# EAGLE design motor-slaves (EAGLE 9.5.2)
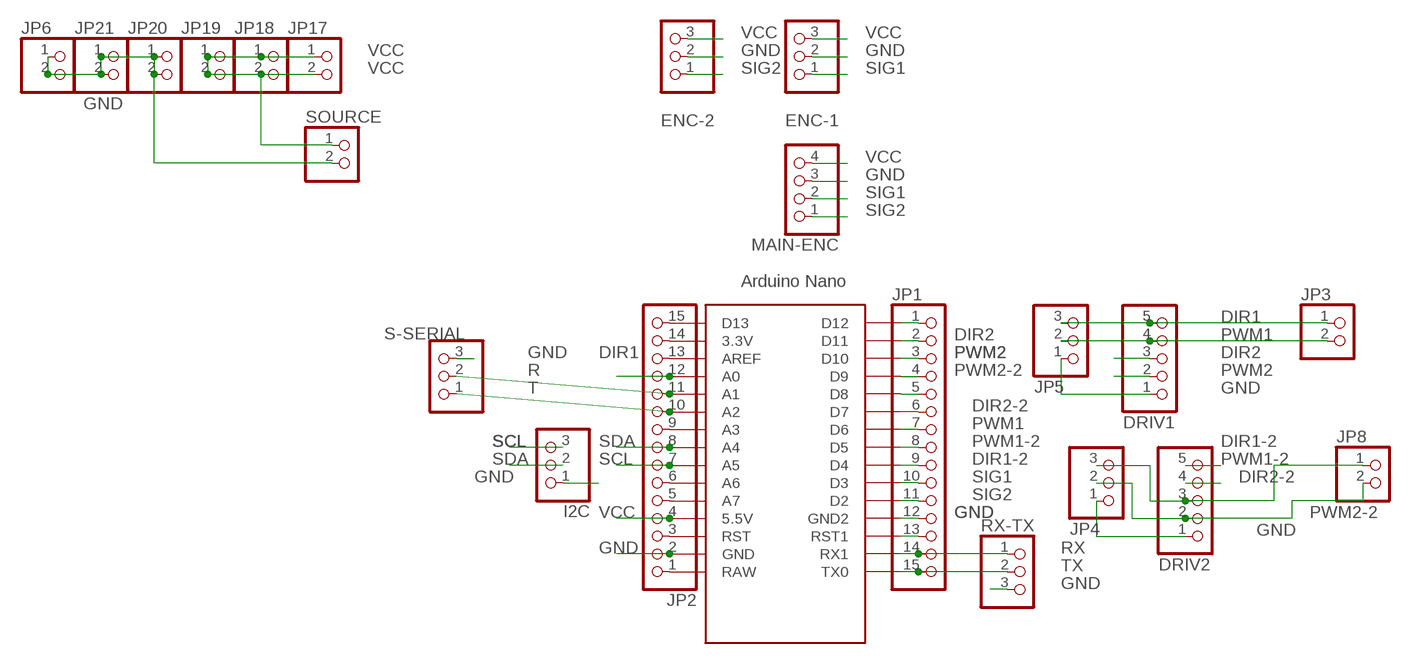
[diagram p0: schematic, sheet 1]

## Parts
DRIV1  PINHD-5_DATA  [1X05_DATA]
DRIV2  PINHD-5_DATA  [1X05_DATA]
ENC-1  PINHD-3_DATA  [1X03_DATA]
ENC-2  PINHD-3_DATA  [1X03_DATA]
I2C  PINHD-3_DATA  [1X03_DATA]
JP1  PINHD-1X15  [1X15]
JP2  PINHD-1X15  [1X15]
JP3  PINHD-2_DATA  [1X02_DATA]
JP4  PINHD-3_DATA  [1X03_DATA]
JP5  PINHD-3_DATA  [1X03_DATA]
JP6  PINHD-1X2  [1X02]
JP8  PINHD-2_DATA  [1X02_DATA]
JP17  PINHD-1X2  [1X02]
JP18  PINHD-1X2  [1X02]
JP19  PINHD-1X2  [1X02]
JP20  PINHD-1X2  [1X02]
JP21  PINHD-1X2  [1X02]
MAIN-ENC  PINHD-4_DATA  [1X04_DATA]
RX-TX  PINHD-3_DATA  [1X03_DATA]
S-SERIAL  PINHD-3_DATA  [1X03_DATA]
SOURCE  PINHD-1X2  [1X02]
U$1  ARDUINO_NANO  [NANO]

## Nets
DIR1: DRIV1.5 JP2.12 JP3.1 JP5.3 U$1.A0
DIR1-2: DRIV2.5 JP1.9 U$1.D4
DIR2: DRIV1.3 JP1.2 U$1.D11
DIR2-2: DRIV2.3 JP1.6 JP4.3 JP8.1 U$1.D7
GND: DRIV1.1 DRIV2.1 ENC-1.2 ENC-2.2 I2C.1 JP1.12 JP2.2 JP4.1 JP5.1 JP6.1 JP6.2 JP20.1 JP20.2 JP21.1 JP21.2 MAIN-ENC.3 RX-TX.3 S-SERIAL.3 SOURCE.2 U$1.GND U$1.GND1(GND2)
N$1: JP1.1 U$1.D12
N$2: JP1.5 U$1.D8
N$13: JP1.13 U$1.RST1
N$16: JP2.1 U$1.RAW
N$18: JP2.3 U$1.RST
N$20: JP2.5 U$1.A7
N$21: JP2.6 U$1.A6
N$24: JP2.9 U$1.A3
N$28: JP2.13 U$1.AREF
N$29: JP2.14 U$1.3.3V
N$30: JP2.15 U$1.D13
PWM1: DRIV1.4 JP1.7 JP3.2 JP5.2 U$1.D6
PWM1-2: DRIV2.4 JP1.8 U$1.D5
PWM2: DRIV1.2 JP1.3 U$1.D10
PWM2-2: DRIV2.2 JP1.4 JP4.2 JP8.2 U$1.D9
R: JP2.11 S-SERIAL.2 U$1.A1
RX: JP1.14 RX-TX.1 U$1.RX1
SCL: I2C.3 JP2.7 U$1.A5
SDA: I2C.2 JP2.8 U$1.A4
SIG1: ENC-1.1 JP1.10 MAIN-ENC.2 U$1.D3
SIG2: ENC-2.1 JP1.11 MAIN-ENC.1 U$1.D2
T: JP2.10 S-SERIAL.1 U$1.A2
TX: JP1.15 RX-TX.2 U$1.TX0
VCC: ENC-1.3 ENC-2.3 JP2.4 JP17.1 JP17.2 JP18.1 JP18.2 JP19.1 JP19.2 MAIN-ENC.4 SOURCE.1 U$1.5V(5.5V)

## Library data of the parts
DRIV1 DRIV2 = MIA_LIBRARY-2-2-2:PINHD-5_DATA: PIN HEADER
ENC-1 ENC-2 I2C JP4 JP5 RX-TX S-SERIAL = MIA_LIBRARY-2-2-2:PINHD-3_DATA: PIN HEADER
JP1 JP2 = MIA_LIBRARY-2-2-2:PINHD-1X15: PIN HEADER
JP3 JP8 = MIA_LIBRARY-2-2-2:PINHD-2_DATA: PIN HEADER
JP6 JP17-JP21 SOURCE = MIA_LIBRARY-2-2-2:PINHD-1X2: PIN HEADER
MAIN-ENC = MIA_LIBRARY-2-2-2:PINHD-4_DATA: PIN HEADER
U$1 = MIA_LIBRARY:ARDUINO_NANO: Arduino Nano

## Board
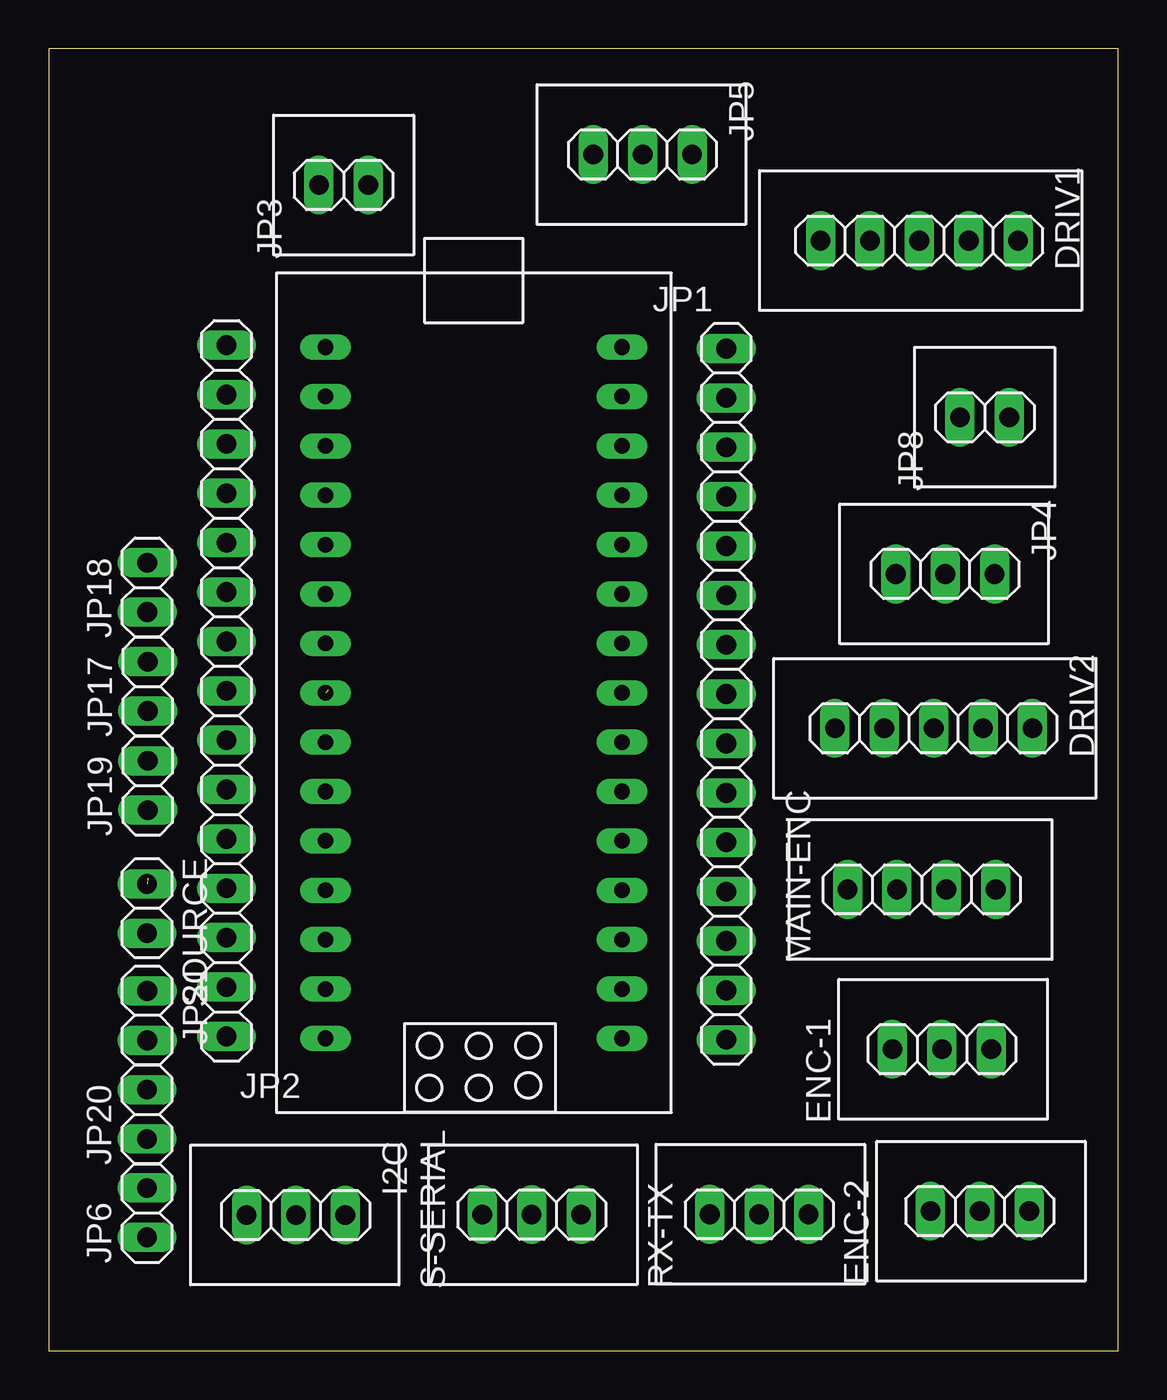
[diagram p1: board, top side]
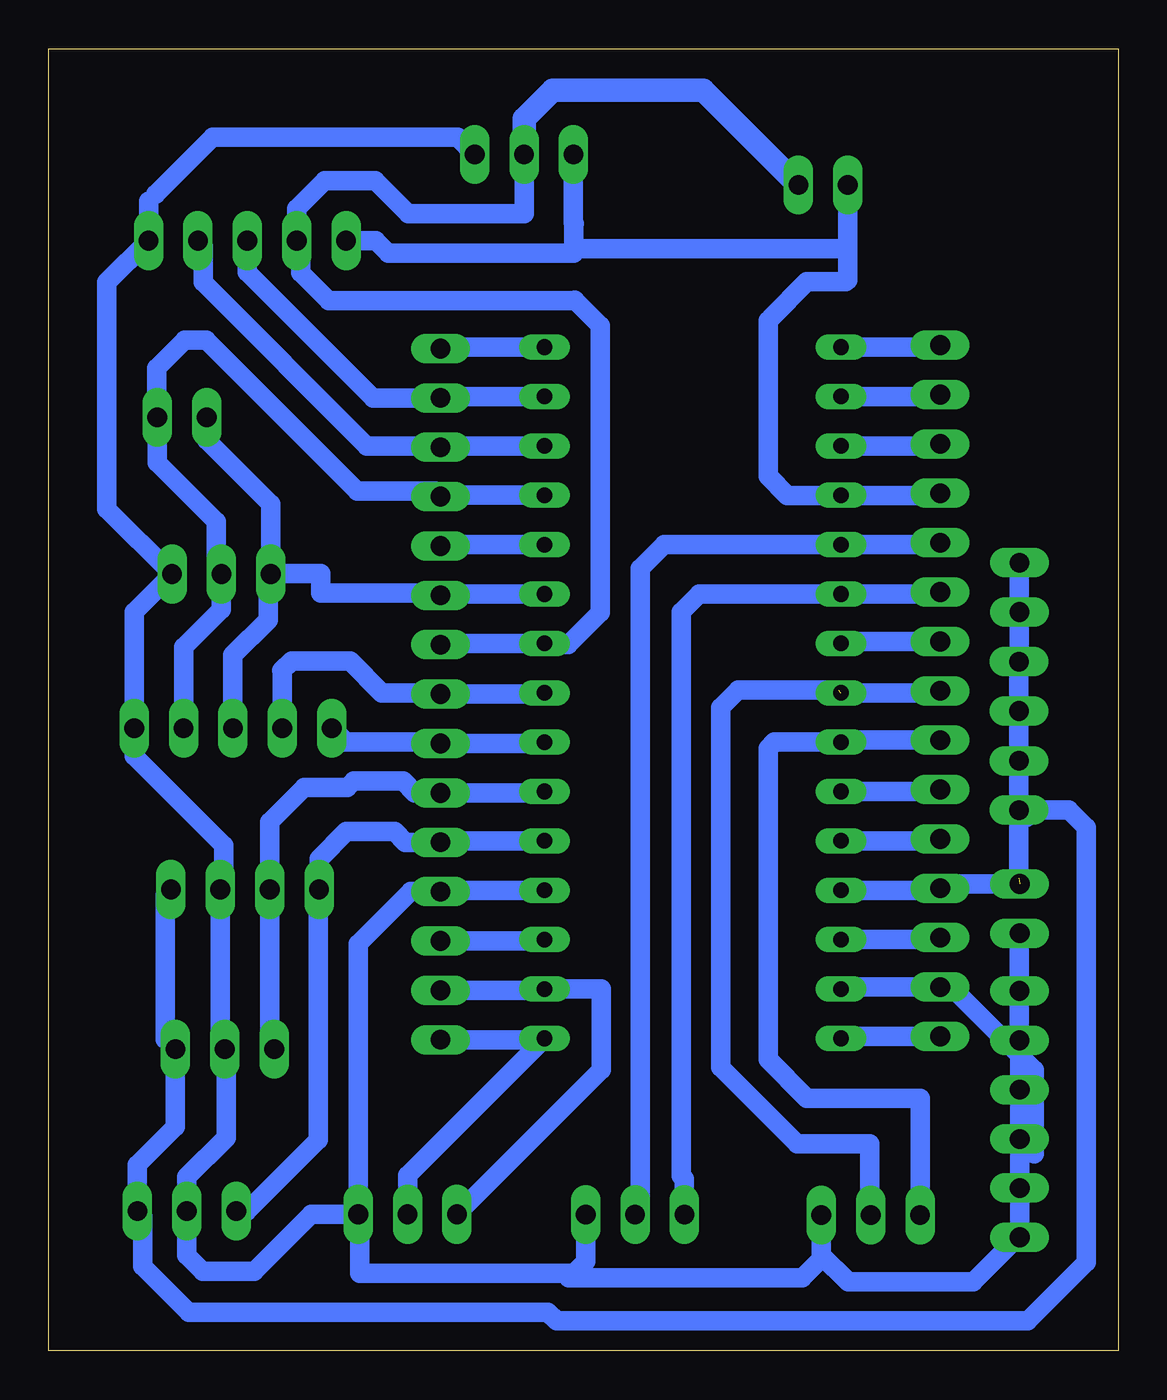
[diagram p2: board, bottom side, seen from below]

Size 55 x 67 mm. Coordinates in mm from the lower left corner, seen from the top.
Outline: 0,0 55,0 55,67 0,67 0,0
Copper layers (1*16): Top 0.035mm / dielectric 1.5mm / Bottom 0.035mm
Design rules "default *": minimum track width 6mil, minimum drill 0.35mm, track to track 1mm, track to pad 1mm, pad to pad 1mm, via to via 1mm, smd to smd 6mil, copper to edge 40mil, drill to drill 6mil, minimum pad ring 10mil, minimum via ring 8mil, stop-mask expansion 4mil, vias tented up to drill 0mil, thermal gap 10mil

### Footprints (pad centres in the part's own frame; a part is rotated, then mirrored left to right if it is on the bottom)
1X05_DATA = drill 1.016 long: 1 -5.08,0; 2 -2.54,0; 3 0,0; 4 2.54,0; 5 5.08,0
1X03_DATA = drill 1.016 long: 1 -2.54,0; 2 0,0; 3 2.54,0
1X15 = drill 1.016 long: 1 -17.78,0; 2 -15.24,0; 3 -12.7,0; 4 -10.16,0; 5 -7.62,0; 6 -5.08,0; 7 -2.54,0; 8 0,0; 9 2.54,0; 10 5.08,0; 11 7.62,0; 12 10.16,0; 13 12.7,0; 14 15.24,0; 15 17.78,0
1X02_DATA = drill 1.016 long: 1 -1.27,0; 2 1.27,0
1X02 = drill 1.016 long: 1 -1.27,0; 2 1.27,0
1X04_DATA = drill 1.016 long: 1 -3.81,0; 2 -1.27,0; 3 1.27,0; 4 3.81,0
NANO = drill 0.8 long: 3.3V -10.16,24.13; 5V -10.16,-1.27; A0 -10.16,19.05; A1 -10.16,16.51; A2 -10.16,13.97; A3 -10.16,11.43; A4 -10.16,8.89; A5 -10.16,6.35; A6 -10.16,3.81; A7 -10.16,1.27; AREF -10.16,21.59; D2 5.08,1.27; D3 5.08,3.81; D4 5.08,6.35; D5 5.08,8.89; D6 5.08,11.43; D7 5.08,13.97; D8 5.08,16.51; D9 5.08,19.05; D10 5.08,21.59; D11 5.08,24.13; D12 5.08,26.67; D13 -10.16,26.67; GND -10.16,-6.35; GND1 5.08,-1.27; RAW -10.16,-8.89; RST -10.16,-3.81; RST1 5.08,-3.81; RX1 5.08,-6.35; TX0 5.08,-8.89

### Placement (x,y rotation side)
DRIV1  44.78,57.12 180 top
DRIV2  45.52,32.03 180 top
ENC-1  45.94,15.52 0 top
ENC-2  47.89,7.19 0 top
I2C  12.72,6.99 180 top
JP1  34.85,33.79 270 top
JP2  9.15,33.96 90 top
JP3  15.17,59.98 0 top
JP4  46.11,39.97 180 top
JP5  30.55,61.55 180 top
JP6  5.06,7.11 90 top
JP8  48.14,48.03 0 top
JP17  5.1,34.19 90 top
JP18  5.07,39.28 90 top
JP19  5.1,29.09 90 top
JP20  5.06,12.17 90 top
JP21  5.07,17.25 270 top
MAIN-ENC  44.9,23.74 0 top
RX-TX  36.54,7.03 0 top
S-SERIAL  24.84,7.01 0 top
SOURCE  5.06,22.76 270 top
U$1  24.41,24.97 0 top

### Tracks (layer width: path | path; a pad name or v marks a point on that pad's centre or on a via)
DIR1
  Bottom 0.6: 27.98,57.98 27.96,58 | 17.85,53.15 18,53
  Bottom 1: DRIV1.5 38.18,57.12 37.54,56.48 27.98,56.48 27.98,56.7 | 27.98,56.7 27.98,57.98 | JP5.3 28.01,58.05 27.96,58 | JP3.1 13.9,56.7 | 13.9,56.7 13.9,55.1 14,55 16,55 17.85,53.15 | 18,53 18,45 17,44 14.27,44 | 14.27,44 U$1.A0 | 14.27,44 9.27,44 JP2.12 | 13.9,56.7 27.98,56.7
DIR1-2
  Bottom 0.6: U$1.D4 34.78,31.32 JP1.9 35.1,31
  Bottom 1: DRIV2.5 39.73,31.32 34.78,31.32 | JP1.9 29.56,31.25 U$1.D4
DIR2
  Bottom 0.6: 28.61,49.1 U$1.D11 30,49.1 29.9,49
  Bottom 1: DRIV1.3 44.78,55.5 38.31,49.03 JP1.2 34.78,49.1 U$1.D11
DIR2-2
  Bottom 0.6: U$1.D7 34.78,38.94 JP1.6 34.98,39
  Bottom 1: JP8.1 46.87,46.87 43.57,43.57 JP4.3 | U$1.D7 34.92,38.94 | 34.92,38.94 34.98,39 41,39 41,40 43.54,40 JP4.3 | JP1.6 34.92,38.94 | JP4.3 43.57,38.98 43.71,38.84 43.71,37.61 45.52,35.8 DRIV2.3
GND
  Bottom 0.6: 49.5,59.5 49.86,59.14
  Bottom 1: JP5.1 33.97,62.43 46.57,62.43 49.5,59.5 | 49.86,59.14 DRIV1.1 52,54.98 52,43.32 JP4.1 50.6,38.02 DRIV2.1 50.6,30.6 46,26 46,23 46.17,23.17 MAIN-ENC.3 46.17,15.75 ENC-1.2 45.87,15.45 45.87,10.97 47.89,8.95 ENC-2.2 47.89,4.92 47.07,4.1 44.42,4.1 41.49,7.03 RX-TX.3 | U$1.GND1 34.78,23.7 JP1.12 36.37,23.63 39.07,20.93 39.07,7.8 39.08,7.79 RX-TX.3 | U$1.GND 14.15,18.72 JP2.2 8.58,18.72 4.31,14.45 4.31,10.15 JP20.1 | JP20.1 JP20.2 JP21.2 JP21.1 SOURCE.2 | JP20.1 JP6.2 JP6.1 5.16,5.84 7.45,3.55 13.88,3.55 15.26,4.93 I2C.1 15.26,4.74 16.25,3.75 28.25,3.75 28,4 | RX-TX.3 39,6.95 39,4 28,4 | 28,4 27.38,4.62 S-SERIAL.3
N$1
  Bottom 1: U$1.D12 34.78,51.64 JP1.1
N$2
  Bottom 1: U$1.D8 34.78,41.48 JP1.5
N$13
  Bottom 1: JP1.13 29.56,21.09 U$1.RST1
N$16
  Bottom 1: U$1.RAW 14.15,16.18 JP2.1
N$18
  Bottom 1: U$1.RST 9.05,21.16 JP2.3
N$20
  Bottom 1: U$1.A7 8.24,26.24 8.34,26.34 JP2.5
N$21
  Bottom 1: U$1.A6 9.25,28.78 JP2.6
N$24
  Bottom 1: JP2.9 14.15,36.5 U$1.A3
N$28
  Bottom 1: U$1.AREF 9.25,46.56 JP2.13
N$29
  Bottom 1: U$1.3.3V 9.25,49.1 JP2.14
N$30
  Bottom 1: JP2.15 9.25,51.64 U$1.D13
PWM1
  Bottom 0.6: JP1.7 29.56,36.33 U$1.D6 28.4,36.4
  Bottom 1: JP5.2 30.55,58.51 36.51,58.51 38.21,60.21 40.79,60.21 42.24,58.76 DRIV1.4 42.03,56.91 42.03,55.47 40.6,54.04 27.91,54.04 | 27.93,54.06 27.91,54.04 | 27.91,54.04 26.62,52.75 26.62,37.98 28.27,36.33 29.56,36.33 | U$1.D6 34.78,36.4 JP1.7
  Bottom 1.2: JP3.2 21.33,64.87 29.08,64.87 30.55,63.4 JP5.2
PWM1-2
  Bottom 0.6: U$1.D5 34.78,33.86 JP1.8 35.06,34
  Bottom 1: DRIV2.4 42.98,34.98 43,35 42.5,35.5 39.5,35.5 37.86,33.86 34.78,33.86 | JP1.8 29.21,33.79 29,34
PWM2
  Bottom 0.6: 34.78,46.56 JP1.3
  Bottom 1: DRIV1.2 47.04,56.84 47.04,54.97 38.63,46.56 34.78,46.56 U$1.D10
PWM2-2
  Bottom 0.6: JP4.2 46.11,40 | 36.11,44.07 34.97,44.07 JP1.4
  Bottom 1: 46.11,40 46.39,40.28 46.39,42.67 49.41,45.69 JP8.2 49.44,48.06 49.44,50.56 48,52 46.91,52 39.13,44.23 35.13,44.23 JP1.4 34.78,44.02 U$1.D9 | JP4.2 46.11,38.15 48.06,36.2 DRIV2.2
R
  Bottom 0.6: 9.25,41.48 JP2.11
  Bottom 1: S-SERIAL.2 24.95,6.9 24.95,6.89 24.56,7.28 24.56,40.26 23.34,41.48 U$1.A1 9.25,41.48
RX
  Bottom 1: JP1.14 29.56,18.55 U$1.RX1 26.57,18.62 26.57,14.46 RX-TX.1
SCL
  Bottom 1: I2C.3 10.18,13 16.01,13 18,14.99 18,31 17.68,31.32 U$1.A5 14.15,31.42 JP2.7
SDA  (1 unrouted)
  Bottom 1: 14.39,34 19.53,34 20.43,33.1 20.43,14.59 16.49,10.65 12.76,10.65 12.76,7.03 I2C.2 | U$1.A4 9.25,33.86 JP2.8
SIG1
  Bottom 1: U$1.D3 29.56,28.71 JP1.10 36.17,28.71 36.77,29.31 39.32,29.31 39.64,28.99 41.85,28.99 43.63,27.21 MAIN-ENC.2 43.63,15.75 ENC-1.1
SIG2
  Bottom 1: U$1.D2 34.78,26.24 JP1.11 36.66,26.17 37.21,26.72 39.69,26.72 41.09,25.32 MAIN-ENC.1 41.13,23.7 41.13,10.87 44.81,7.19 ENC-2.1
T
  Bottom 1: S-SERIAL.1 22.3,8.84 22.47,9.01 22.47,38 21.53,38.94 U$1.A2 9.25,38.94 JP2.10
TX
  Bottom 1: JP1.15 29.56,16.01 U$1.TX0 36.54,9.03 RX-TX.2
VCC  (1 unrouted)
  Bottom 1: MAIN-ENC.4 49,23.45 49,16.04 ENC-1.3 48.48,11.53 50.43,9.58 ENC-2.3 50.15,6.91 50.15,4.35 47.8,2 29.33,2 28.88,1.55 4.65,1.55 1.65,4.56 1.65,26.94 2.53,27.82 JP19.1 | U$1.5V 9.25,23.7 JP2.4 | JP2.4 8.95,24 | JP18.2 JP18.1 5.07,35.49 JP17.2 JP17.1 JP19.2 JP19.1 | JP19.1 4.72,27.44 | JP19.1 5.1,24.32 | JP2.4 9.06,23.89 | SOURCE.1 8.92,24.03 JP2.4